# Altium schematic sheet AdjustableOutputPowerSource.SchDoc
size A4; SheetNumber: 3; SheetTotal: 10
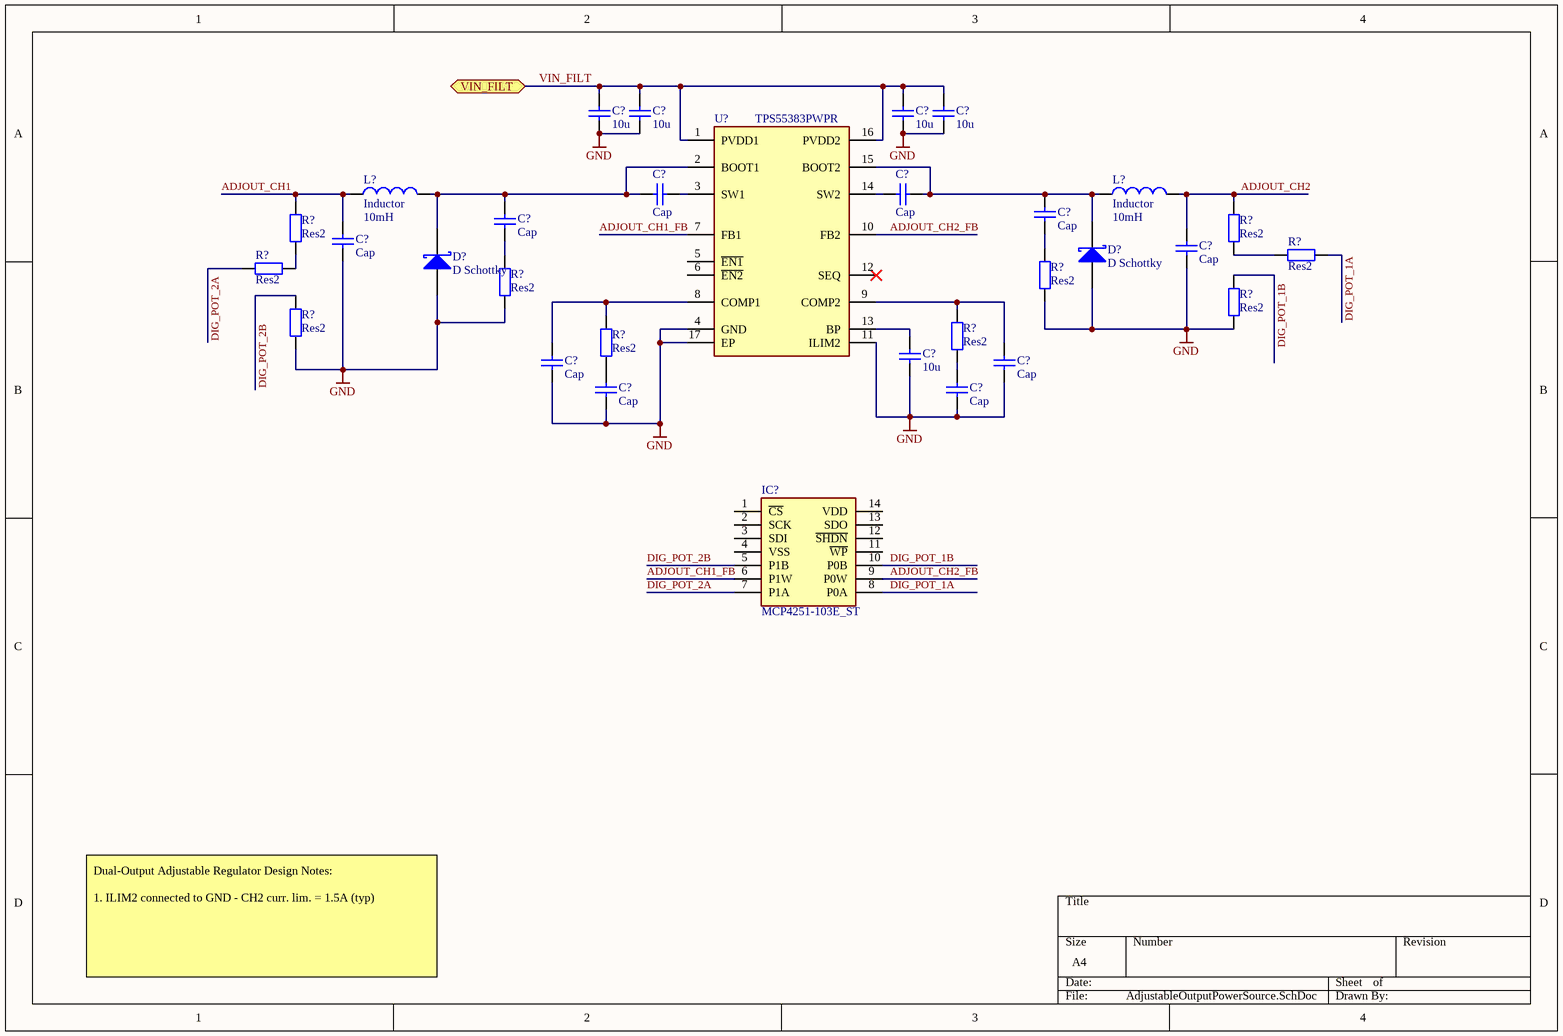
[diagram p0: AdjustableOutputPowerSource.SchDoc]

## Parts
(Parts that share a designator on the sheet are numbered #1, #2 ... from top to bottom, then left to right.)
C?#1  10u  [CAP_0805]
C?#2  10u  [CAP_0805]
C?#3  10u  [CAP_0805]
C?#4  10u  [CAP_0805]
C?#5  Cap  [CAP_0603]
C?#6  Cap  [CAP_0603]
C?#7  Cap  [CAP_0603]
C?#8  Cap  [CAP_0603]
C?#9  Cap  [CAP_0603]
C?#10  Cap  [CAP_0603]
C?#11  10u  [CAP_0805]
C?#12  Cap  [CAP_0603]
C?#13  Cap  [CAP_0603]
C?#14  Cap  [CAP_0603]
C?#15  Cap  [CAP_0603]
D?#1  D Schottky  [SMB]
D?#2  D Schottky  [SMB]
IC?  MCP4251-103E_ST  [SOP65P640X120-14N]
L?#1  Inductor  value 10mH  [0402-A]
L?#2  Inductor  value 10mH  [0402-A]
R?#1  Res2  [RES_0603]
R?#2  Res2  [RES_0603]
R?#3  Res2  [RES_0603]
R?#4  Res2  [RES_0603]
R?#5  Res2  [RES_0603]
R?#6  Res2  [RES_0603]
R?#7  Res2  [RES_0603]
R?#8  Res2  [RES_0603]
R?#9  Res2  [RES_0603]
R?#10  Res2  [RES_0603]
U?  TPS55383PWPR  [SOP65P640X120-17N]

## Ports
VIN_FILT (bidir)

## Nets
GND: C?#1.2 C?#2.2 C?#3.1 C?#4.1 C?#9.1 C?#10.1 C?#11.2 C?#12.1 C?#13.1 C?#14.1 C?#15.1 D?#1.1(A) D?#2.1(A) R?#5.1 R?#6.1 R?#7.1 R?#8.1 U?.4(GND) U?.11(ILIM2) U?.17(EP)
ADJOUT_CH1: C?#9.2 L?#1.2 R?#1.2
ADJOUT_CH1_FB: IC?.6(P1W) U?.7(FB1)
ADJOUT_CH2: C?#10.2 L?#2.2 R?#2.2
ADJOUT_CH2_FB: IC?.9(P0W) U?.10(FB2)
DIG_POT_1A: IC?.8(P0A) R?#3.1
DIG_POT_1B: IC?.10(P0B) R?#7.2
DIG_POT_2A: IC?.7(P1A) R?#4.2
DIG_POT_2B: IC?.5(P1B) R?#8.2
VIN_FILT: C?#1.1 C?#2.1 C?#3.2 C?#4.2 U?.1(PVDD1) U?.16(PVDD2) ; port VIN_FILT
NetC?#5_1: C?#5.1 C?#8.2 D?#2.2(K) L?#1.1 U?.2(BOOT1)
NetC?#5_2: C?#5.2 U?.3(SW1)
NetC?#6_1: C?#6.1 U?.14(SW2)
NetC?#6_2: C?#6.2 C?#7.2 D?#1.2(K) L?#2.1 U?.15(BOOT2)
NetC?#7_1: C?#7.1 R?#5.2
NetC?#8_1: C?#8.1 R?#6.2
NetC?#11_1: C?#11.1 U?.13(BP)
NetC?#12_2: C?#12.2 R?#10.2 U?.8(COMP1)
NetC?#13_2: C?#13.2 R?#9.2 U?.9(COMP2)
NetC?#14_2: C?#14.2 R?#10.1
NetC?#15_2: C?#15.2 R?#9.1
NetR?#1_1: R?#1.1 R?#4.1
NetR?#2_1: R?#2.1 R?#3.2

Not connected (* = marked no-connect by the designer): IC? 1(~{CS}) 2(SCK) 3(SDI) 4(VSS) 11(~{WP}) 12(~{SHDN}) 13(SDO) 14(VDD); U? 5(~{EN1}) 6(~{EN2}) 12(SEQ)*

## Notes on the sheet
- Dual-Output Adjustable Regulator Design Notes:
  1. ILIM2 connected to GND - CH2 curr. lim. = 1.5A (typ)

## Library data of the parts
C?#1-C?#4 C?#11 = Cap: Capacitor; Manufacturer Part Number: CL21A106KOQNNNG
C?#5-C?#10 C?#12-C?#15 = Cap: Capacitor; Value: 100pF; Published: 8-Jun-2000; LatestRevisionDate: 17-Jul-2002; LatestRevisionNote: Re-released for DXP Platform.; PackageReference: RAD-0.3; Publisher: Altium Limited; PackageDescription: Radial Cap, Thru-Hole; 2 Leads; 0.3 in Pin Spacing
D?#1 D?#2 = D Schottky: Schottky Diode; Published: 8-Jun-2000; LatestRevisionDate: 17-Jul-2002; LatestRevisionNote: Re-released for DXP Platform.; PackageReference: SMB; Publisher: Altium Limited; PackageDescription: DO-214-AA/SMB; 2 C-Bend Leads; Body 5.3 x 3.6 mm, inc. leads (LxW); Code_JEDEC: DO-214-AA
IC? = MCP4251-103E_ST: Integrated Circuit; Manufacturer_Name: Microchip; Manufacturer_Part_Number: MCP4251-103E/ST; Datasheet Link: https://www.arrow.com/en/products/mcp4251-103est/microchip-technology; Height: 1.2mm; Mouser Part Number: 579-MCP4251103EST; Mouser Price/Stock: https://www.mouser.co.uk/ProductDetail/Microchip-Technology/MCP4251-103E-ST?qs=MsrkbSoMqzMHaqHwFROWpg%3D%3D; Arrow Part Number: MCP4251-103E/ST; Arrow Price/Stock: https://www.arrow.com/en/products/mcp4251-103est/microchip-technology?region=nac
L?#1 L?#2 = Inductor: Code_IEC: 1005; Published: 8-Jun-2000; LatestRevisionDate: 29-May-2009; LatestRevisionNote: IPC-7351 Footprint Added.; PackageReference: 0402-A; Publisher: Altium Limited; PackageDescription: Chip Inductor; Code_JEITA: 0402
R?#1-R?#10 = Res2: Resistor; Value: 1K; Published: 8-Jun-2000; LatestRevisionDate: 17-Jul-2002; LatestRevisionNote: Re-released for DXP Platform.; PackageReference: AXIAL-0.4; Publisher: Altium Limited; PackageDescription: Axial Device, Thru-Hole; 2 Leads; 0.4 in Pin Spacing
U? = TPS55383PWPR: Integrated Circuit; Manufacturer_Name: Texas Instruments; Datasheet Link: http://www.ti.com/lit/gpn/tps55383; Height: 1.2mm; Manufacturer_Part_Number: TPS55383PWPR